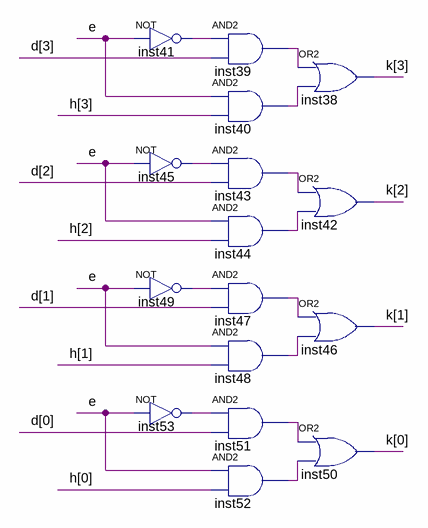
[diagram p0: schematic sheet]
// Quartus schematic payamTest.bdf as structural Verilog: 16 symbols, 0 pins
module payamTest (
);

  wire e, inst39_out, inst40_out, inst41_out, inst43_out, inst44_out, inst45_out, inst47_out, inst48_out,
       inst49_out, inst51_out, inst52_out, inst53_out;
  wire [3:0] d, h, k;

  not inst41 (inst41_out, e);
  not inst45 (inst45_out, e);
  not inst49 (inst49_out, e);
  not inst53 (inst53_out, e);
  and inst39 (inst39_out, inst41_out, d[3]);
  and inst40 (inst40_out, e, h[3]);
  and inst43 (inst43_out, inst45_out, d[2]);
  and inst44 (inst44_out, e, h[2]);
  and inst47 (inst47_out, inst49_out, d[1]);
  and inst48 (inst48_out, e, h[1]);
  and inst51 (inst51_out, inst53_out, d[0]);
  and inst52 (inst52_out, e, h[0]);
  or inst38 (k[3], inst39_out, inst40_out);
  or inst42 (k[2], inst43_out, inst44_out);
  or inst46 (k[1], inst47_out, inst48_out);
  or inst50 (k[0], inst51_out, inst52_out);
endmodule
